# Altium schematic sheet Proc.SchDoc
size A; SheetNumber: 1; SheetTotal: 4
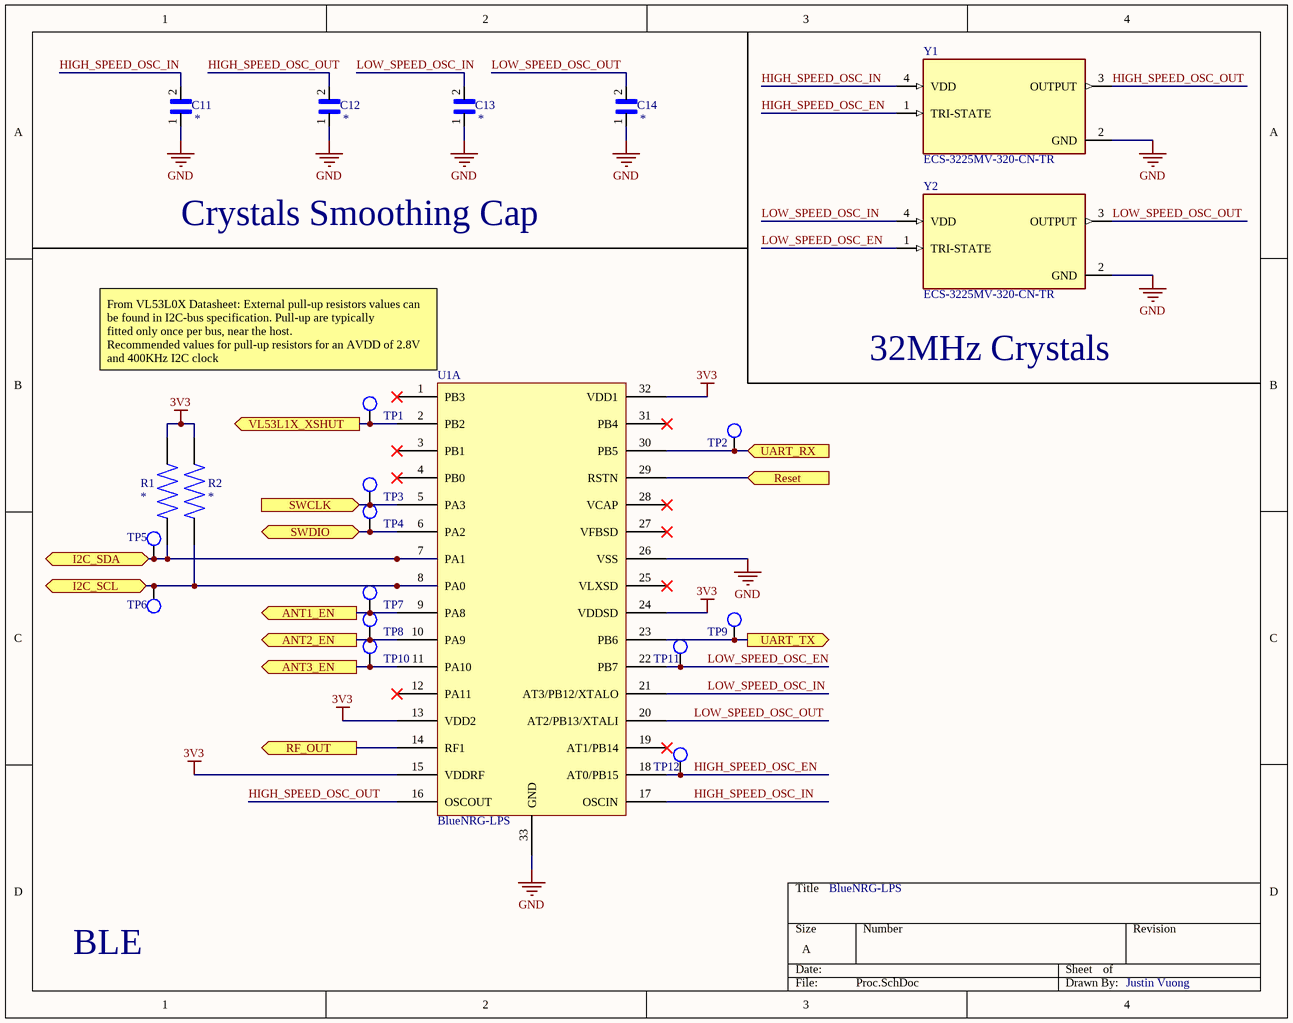
[diagram p0: Proc.SchDoc]

## Parts
C11  04025A8R2CAT2A  [CAPC1005X56N]  (value not drawn)
C12  04025A8R2CAT2A  [CAPC1005X56N]  (value not drawn)
C13  04025A8R2CAT2A  [CAPC1005X56N]  (value not drawn)
C14  04025A8R2CAT2A  [CAPC1005X56N]  (value not drawn)
R1  RC0402JR-072KL  [RESC1005X40N]  (value not drawn)
R2  RC0402JR-072KL  [RESC1005X40N]  (value not drawn)
TP1  TESTPOINT_LOOP  [PCBComponent_1]  (value not drawn)
TP2  TESTPOINT_LOOP  [PCBComponent_1]  (value not drawn)
TP3  TESTPOINT_LOOP  [PCBComponent_1]  (value not drawn)
TP4  TESTPOINT_LOOP  [PCBComponent_1]  (value not drawn)
TP5  TESTPOINT_LOOP  [PCBComponent_1]  (value not drawn)
TP6  TESTPOINT_LOOP  [PCBComponent_1]  (value not drawn)
TP7  TESTPOINT_LOOP  [PCBComponent_1]  (value not drawn)
TP8  TESTPOINT_LOOP  [PCBComponent_1]  (value not drawn)
TP9  TESTPOINT_LOOP  [PCBComponent_1]  (value not drawn)
TP10  TESTPOINT_LOOP  [PCBComponent_1]  (value not drawn)
TP11  TESTPOINT_LOOP  [PCBComponent_1]  (value not drawn)
TP12  TESTPOINT_LOOP  [PCBComponent_1]  (value not drawn)
U1  BlueNRG-LPS  [VFQFPN32-5x5mm-M]  (part A of 3)
Y1  ECS-3225MV-320-CN-TR  [OSC_ECS-2333-160-BN-TR]
Y2  ECS-3225MV-320-CN-TR  [OSC_ECS-2333-160-BN-TR]

## Ports
ANT1_EN (out, see Antenna[2C]), ANT2_EN (out, see Antenna[1D]), ANT3_EN (out, see Antenna[1C]), I2C_SCL (bidir, see Sensor[1B]), I2C_SDA (bidir, see Sensor[1B]), Reset (in, see Power[4A]), RF_OUT (out, see Antenna[1A]), SWCLK (in, see Power[3A]), SWDIO (bidir, see Power[3A]), UART_RX (in, see Power[4A]), UART_TX (out, see Power[4A]), VL53L1X_XSHUT (out, see Sensor[1A])

## Nets
3V3: R1.2 R2.1 U1.13(VDD2) U1.15(VDDRF) U1.24(VDDSD) U1.32(VDD1)
GND: C11.1 C12.1 C13.1 C14.1 U1.26(VSS) U1.33(GND) Y1.2(GND) Y2.2(GND)
ANT1_EN: TP7.1 U1.9(PA8) ; port ANT1_EN
ANT2_EN: TP8.1 U1.10(PA9) ; port ANT2_EN
ANT3_EN: TP10.1 U1.11(PA10) ; port ANT3_EN
HIGH_SPEED_OSC_EN: TP12.1 U1.18(AT0/PB15) Y1.1(TRI-STATE)
HIGH_SPEED_OSC_IN: C11.2 U1.17(OSCIN) Y1.4(VDD)
HIGH_SPEED_OSC_OUT: C12.2 U1.16(OSCOUT) Y1.3(OUTPUT)
I2C_SCL: R2.2 TP6.1 U1.8(PA0) ; port I2C_SCL
I2C_SDA: R1.1 TP5.1 U1.7(PA1) ; port I2C_SDA
LOW_SPEED_OSC_EN: TP11.1 U1.22(PB7) Y2.1(TRI-STATE)
LOW_SPEED_OSC_IN: C13.2 U1.21(AT3/PB12/XTALO) Y2.4(VDD)
LOW_SPEED_OSC_OUT: C14.2 U1.20(AT2/PB13/XTALI) Y2.3(OUTPUT)
Reset: U1.29(RSTN) ; port Reset
RF_OUT: U1.14(RF1) ; port RF_OUT
SWCLK: TP3.1 U1.5(PA3) ; port SWCLK
SWDIO: TP4.1 U1.6(PA2) ; port SWDIO
UART_RX: TP2.1 U1.30(PB5) ; port UART_RX
UART_TX: TP9.1 U1.23(PB6) ; port UART_TX
VL53L1X_XSHUT: TP1.1 U1.2(PB2) ; port VL53L1X_XSHUT

Not connected (* = marked no-connect by the designer): U1 1(PB3)* 3(PB1)* 4(PB0)* 12(PA11)* 19(AT1/PB14)* 25(VLXSD)* 27(VFBSD)* 28(VCAP)* 31(PB4)*

## Notes on the sheet
- Crystals Smoothing Cap
- From VL53L0X Datasheet: External pull-up resistors values can be found in I2C-bus specification. Pull-up are typically
  fitted only once per bus, near the host.
  Recommended values for pull-up resistors for an AVDD of 2.8V and 400KHz I2C clock
  would be 1.5k to 2k Ohms.
- 32MHz Crystals
- BlueNRG-LPS
- BLE
- Justin Vuong

## Library data of the parts
C11-C14 = 04025A8R2CAT2A: 0402 8,2 pF 50 V Â± 0,25 pF TolÃ©rance C0G / NP0 Condensateur cÃ©ramique multicouche SMT; MF: AVX; Digi-Key_Purchase_URL: https://www.digikey.tn/product-detail/en/avx-corporation/04025A8R2CAT2A/478-1069-1-ND/564101?utm_source=snapeda&utm_medium=aggregator&utm_campaign=symbol; Digi-Key_Part_Number: 478-1069-1-ND; Package: 1005 AVX; Value: *; MP: 04025A8R2CAT2A; SnapEDA_Link: https://www.snapeda.com/parts/04025A8R2CAT2A/AVX/view-part/449449/?ref=snap
R1 R2 = RC0402JR-072KL: 2 kOhms Â±5% 0.063W, 1/16W Chip Resistor 0402 (1005 Metric) Moisture Resistant Thick Film; MF: Yageo; DigiKey_Part_Number: 311-2.0KJRTR-ND; Purchase-URL: https://pricing.snapeda.com/search?q=RC0402JR-072KL&ref=eda; Package: 1005 Panasonic Electronic Components; Check_prices: https://www.snapeda.com/parts/RC0402JR-072KL/Yageo/view-part/?ref=eda; Value: *; SnapEDA_Link: https://www.snapeda.com/parts/RC0402JR-072KL/Yageo/view-part/?ref=snap; MP: RC0402JR-072KL
TP1-TP12 = TESTPOINT_LOOP: PC TEST POINT MINIATURE WHITE; Manufacturer 1: Keystone Electronics; Manufacturer Part Number 1: 5002; Supplier Part Number 1: 36-5002-ND; Supplier 1: Digi-Key; Mount: Through Hole
U1 = BlueNRG-LPS: IC RF TxRx + MCU Bluetooth Bluetooth v5.3 2.4GHz 32-VFQFN Exposed Pad; Supplier 1: Mouser; Supplier Part Number 1: 511-BLUENRG-332AT
Y1 Y2 = ECS-3225MV-320-CN-TR: subminiature SMD oscillators.; Package: None; Price: None; Value: *; MP: ECS-3225MV-320-CN-TR; Availability: Unavailable